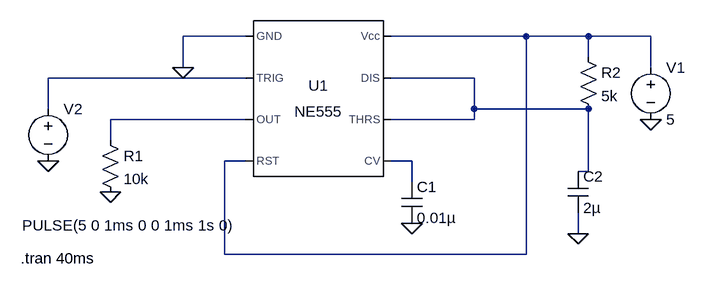
[diagram p0: schematic new monostable 555 timer.asc]
new monostable 555 timer.asc, the LTspice schematic file:
Version 4
SHEET 1 880 680
WIRE 112 80 16 80
WIRE 544 80 336 80
WIRE 640 80 544 80
WIRE 736 80 640 80
WIRE 640 112 640 80
WIRE 16 128 16 80
WIRE 736 128 736 80
WIRE 112 144 -192 144
WIRE 464 144 336 144
WIRE -192 192 -192 144
WIRE 464 192 464 144
WIRE 640 192 464 192
WIRE 112 208 -96 208
WIRE 464 208 464 192
WIRE 464 208 336 208
WIRE -96 240 -96 208
WIRE 112 272 80 272
WIRE 368 272 336 272
WIRE 640 288 640 192
WIRE 640 288 624 288
WIRE 368 304 368 272
WIRE 624 384 624 352
WIRE 80 416 80 272
WIRE 544 416 544 80
WIRE 544 416 80 416
FLAG 16 128 0
FLAG 368 368 0
FLAG -96 320 0
FLAG 736 208 0
FLAG -192 272 0
FLAG 624 384 0
SYMBOL Misc\\NE555 224 176 R0
SYMATTR InstName U1
SYMBOL cap 352 304 R0
SYMATTR InstName C1
SYMATTR Value 0.01µ
SYMBOL res -112 224 R0
SYMATTR InstName R1
SYMATTR Value 10k
SYMBOL voltage 736 112 R0
WINDOW 123 0 0 Left 0
WINDOW 39 0 0 Left 0
SYMATTR InstName V1
SYMATTR Value 5
SYMBOL voltage -192 176 R0
WINDOW 3 -40 195 Left 2
WINDOW 123 0 0 Left 0
WINDOW 39 0 0 Left 0
SYMATTR InstName V2
SYMATTR Value PULSE(5 0 1ms 0 0 1ms 1s 0)
SYMBOL cap 608 288 R0
SYMATTR InstName C2
SYMATTR Value 2µ
SYMBOL res 624 96 R0
SYMATTR InstName R2
SYMATTR Value 5k
TEXT -234 422 Left 2 !.tran 40ms

The netlist it stands for:
* new monostable 555 timer.asc
XU1 0 N002 N004 N001 N005 N003 N003 N001 NE555  ; pins GND TRIG OUT RST CV THRS DIS Vcc
C1 N005 0 0.01µ
R1 N004 0 10k
V1 N001 0 5
V2 N002 0 PULSE(5 0 1ms 0 0 1ms 1s 0)
C2 N003 0 2µ
R2 N001 N003 5k
.tran 40ms
.lib NE555.sub
.backanno
.end